# EAGLE schematic NIPCB (EAGLE 9.7.0)

## Sheet 1 of 6
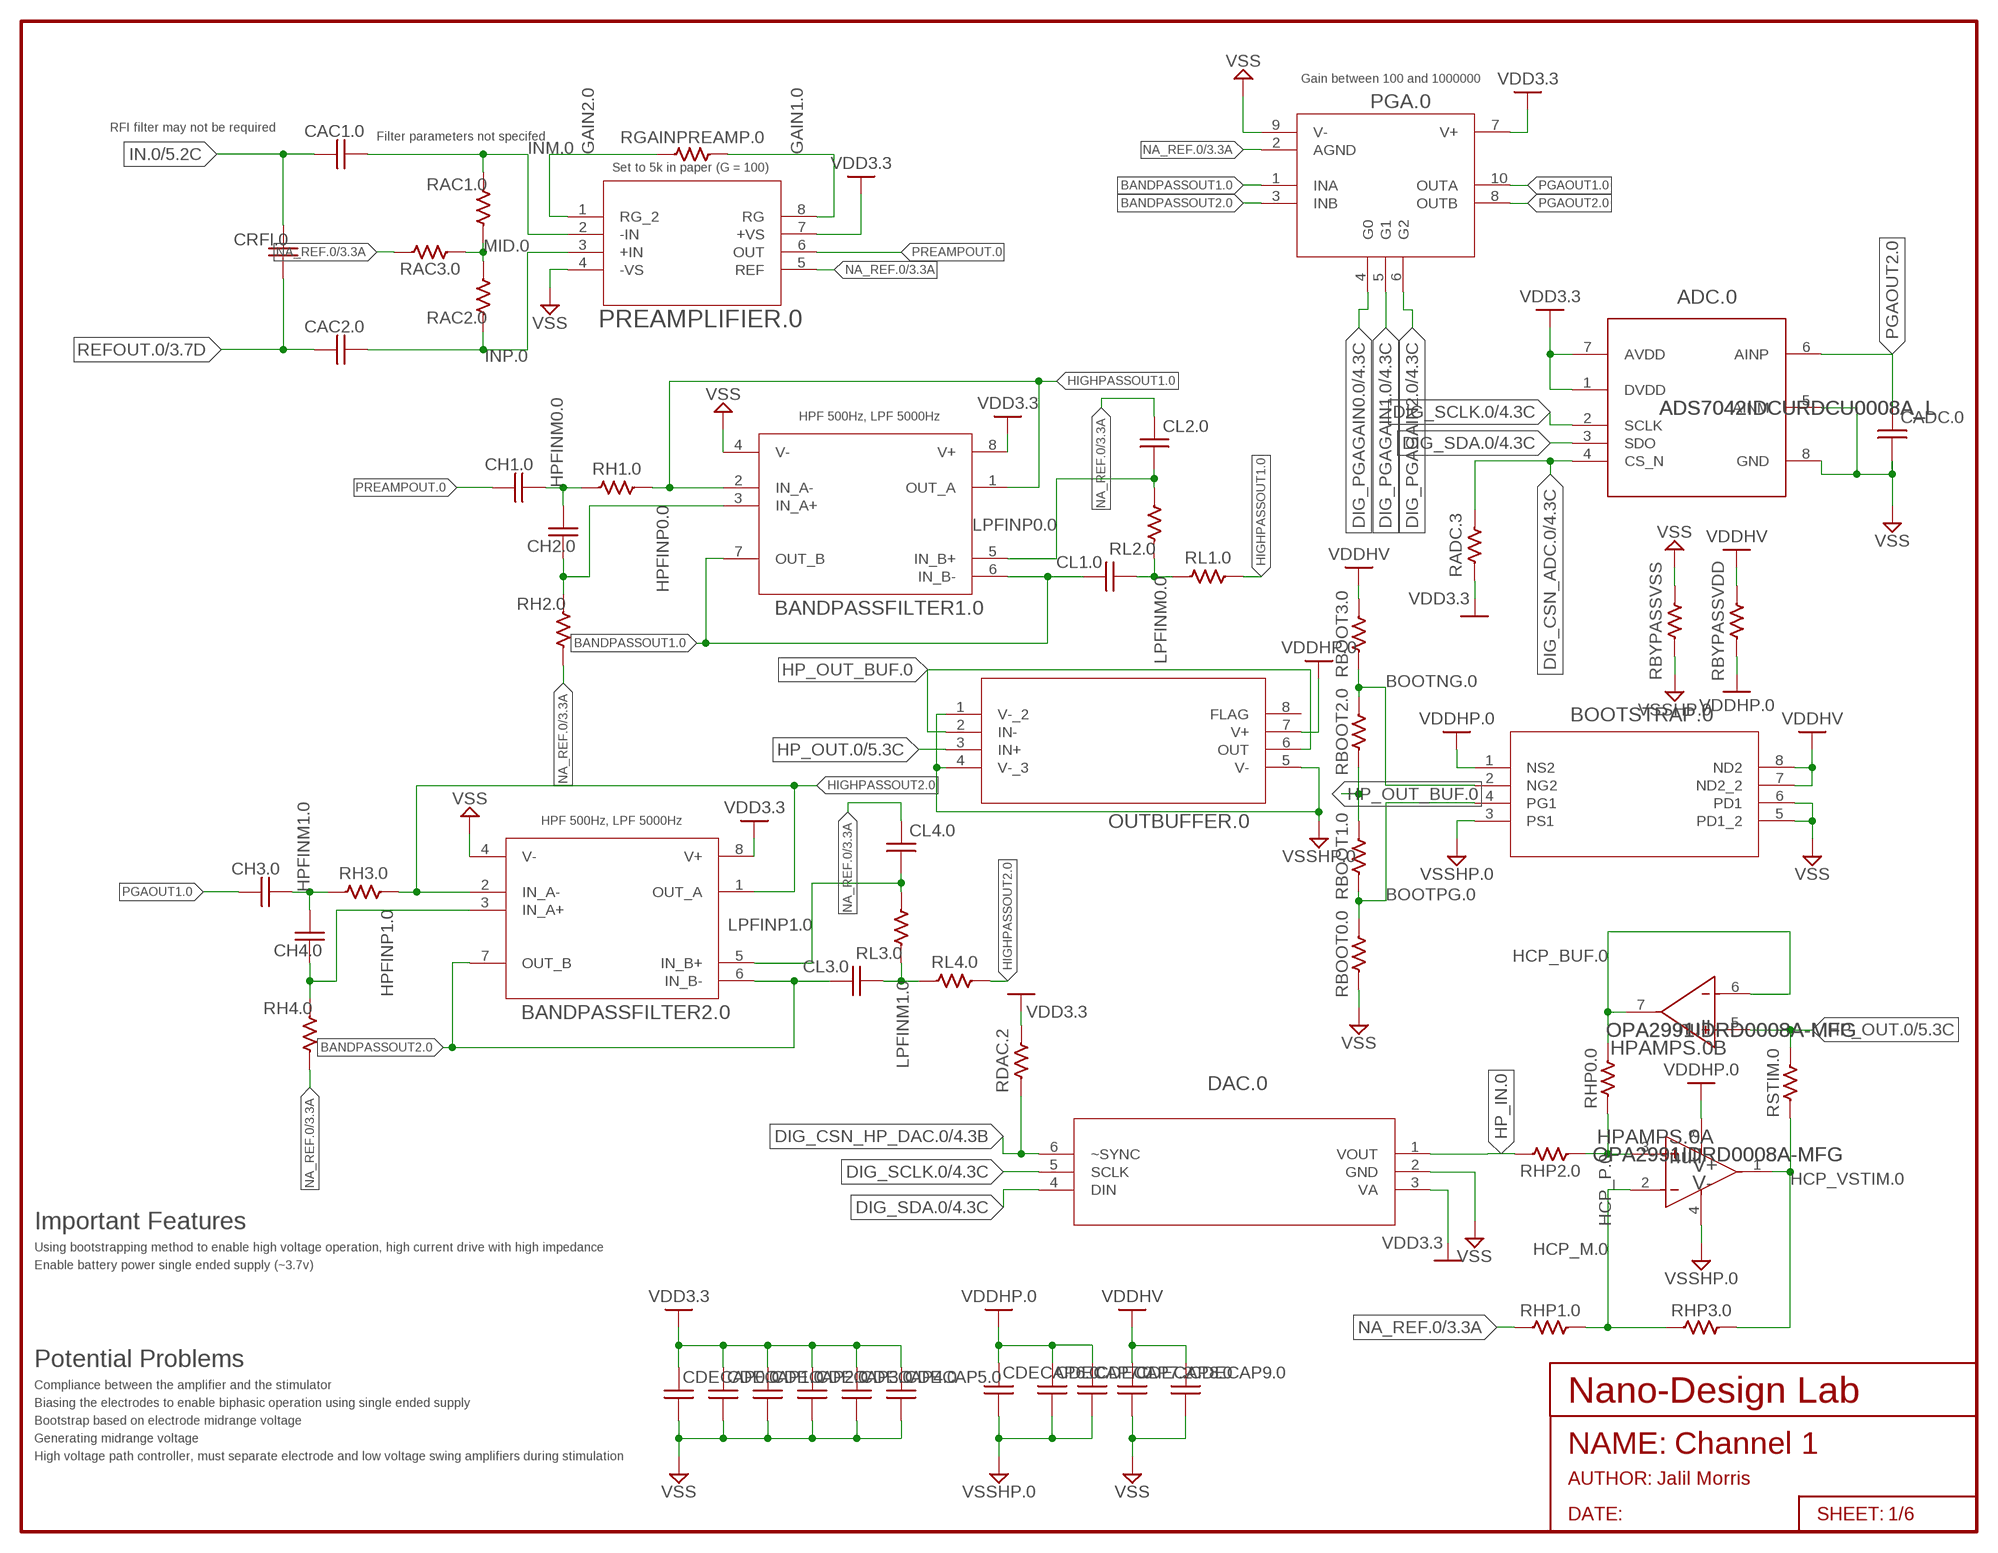
[diagram p0: schematic, sheet 1]
FRAME1 (FRAME): S_AUTHOR: Jalil Morris; S_NAME: Channel 1; S_ORGANIZATION: Nano-Design Lab

### Parts
ADC.0  ADS7042IDCURDCU0008A_L  [DCU0008A_L]
BANDPASSFILTER1.0  OPA2325IDRD8_TEX  [D8_TEX]
BANDPASSFILTER2.0  OPA2325IDRD8_TEX  [D8_TEX]
BOOTSTRAP.0  DMC4047LSD-13SO8_DIO  [SO8_DIO]
CAC1.0  C-US0402  [0402]
CAC2.0  C-US0402  [0402]
CADC.0  C-US0402  [0402]
CDECAP0.0  C-US0402  [0402]
CDECAP1.0  C-US0402  [0402]
CDECAP2.0  C-US0402  [0402]
CDECAP3.0  C-US0402  [0402]
CDECAP4.0  C-US0402  [0402]
CDECAP5.0  C-US0402  [0402]
CDECAP6.0  C-US0402  [0402]
CDECAP7.0  C-US0402  [0402]
CDECAP7.2  C-US0402  [0402]
CDECAP8.0  C-US0402  [0402]
CDECAP9.0  C-US0402  [0402]
CH1.0  C-US0402  [0402]
CH2.0  C-US0402  [0402]
CH3.0  C-US0402  [0402]
CH4.0  C-US0402  [0402]
CL1.0  C-US0402  [0402]
CL2.0  C-US0402  [0402]
CL3.0  C-US0402  [0402]
CL4.0  C-US0402  [0402]
CRFI.0  C-US0402  [0402]
DAC.0  DAC081S101CIMKX/NOPBMK06A  [MK06A]
HPAMPS.0  OPA2991IDRD0008A-MFG  [D0008A-MFG]
OUTBUFFER.0  OPA552UA/2K5D8  [D8]
PGA.0  LTC6911CMS-1TRPBFMSOP-10_MS_LIT  [MSOP-10_MS_LIT]
PREAMPLIFIER.0  INA818IDSOIC-8_TEX  [SOIC-8_TEX]
RAC1.0  R-US0402  [0402]
RAC2.0  R-US0402  [0402]
RAC3.0  R-US0402  [0402]
RADC.3  R-US0402  [0402]
RBOOT0.0  R-US0603  [0603]
RBOOT1.0  R-US0603  [0603]
RBOOT2.0  R-US0603  [0603]
RBOOT3.0  R-US0603  [0603]
RBYPASSVDD  R-US0402  [0402]
RBYPASSVSS  R-US0402  [0402]
RDAC.2  R-US0402  [0402]
RGAINPREAMP.0  R-US0402  [0402]
RH1.0  R-US0402  [0402]
RH2.0  R-US0402  [0402]
RH3.0  R-US0402  [0402]
RH4.0  R-US0402  [0402]
RHP0.0  R-US0603  [0603]
RHP1.0  R-US0603  [0603]
RHP2.0  R-US0603  [0603]
RHP3.0  R-US0603  [0603]
RL1.0  R-US0402  [0402]
RL2.0  R-US0402  [0402]
RL3.0  R-US0402  [0402]
RL4.0  R-US0402  [0402]
RSTIM.0  R-US0603  [0603]

### Nets
BANDPASSOUT1.0: BANDPASSFILTER1.0.6(IN_B-) BANDPASSFILTER1.0.7(OUT_B) CL1.0.1 PGA.0.1(INA)
BANDPASSOUT2.0: BANDPASSFILTER2.0.6(IN_B-) BANDPASSFILTER2.0.7(OUT_B) CL3.0.1 PGA.0.3(INB)
BOOTNG.0: BOOTSTRAP.0.2(NG2) RBOOT2.0.2 RBOOT3.0.1
BOOTPG.0: BOOTSTRAP.0.4(PG1) RBOOT0.0.2 RBOOT1.0.1
DIG_CSN_ADC.0: ADC.0.4(CS_N) RADC.3.1 ; also sheet 4
DIG_CSN_HP_DAC.0: DAC.0.6(~SYNC) RDAC.2.2 ; also sheet 4
DIG_PGAGAIN0.0: PGA.0.4(G0) ; also sheet 4
DIG_PGAGAIN1.0: PGA.0.5(G1) ; also sheet 4
DIG_PGAGAIN2.0: PGA.0.6(G2) ; also sheet 4
DIG_SCLK.0: ADC.0.2(SCLK) DAC.0.5(SCLK) ; also sheet 4
DIG_SDA.0: ADC.0.3(SDO) DAC.0.4(DIN) ; also sheet 4
GAIN1.0: PREAMPLIFIER.0.8(RG) RGAINPREAMP.0.1
GAIN2.0: PREAMPLIFIER.0.1(RG_2) RGAINPREAMP.0.2
HCP_BUF.0: HPAMPS.0.6(B:IN2-) HPAMPS.0.7(B:OUT2) RHP0.0.2
HCP_M.0: HPAMPS.0.2(A:IN1-) RHP1.0.2 RHP3.0.1
HCP_P.0: HPAMPS.0.3(A:IN1+) RHP0.0.1 RHP2.0.1
HCP_VSTIM.0: HPAMPS.0.1(A:OUT1) RHP3.0.2 RSTIM.0.1
HIGHPASSOUT1.0: BANDPASSFILTER1.0.1(OUT_A) BANDPASSFILTER1.0.2(IN_A-) RH1.0.1 RL1.0.1
HIGHPASSOUT2.0: BANDPASSFILTER2.0.1(OUT_A) BANDPASSFILTER2.0.2(IN_A-) RH3.0.1 RL4.0.1
HP_IN.0: DAC.0.1(VOUT) RHP2.0.2
HP_OUT.0: HPAMPS.0.5(B:IN2+) OUTBUFFER.0.3(IN+) RSTIM.0.2 ; also sheet 5
HP_OUT_BUF.0: OUTBUFFER.0.2(IN-) OUTBUFFER.0.6(OUT) RBOOT1.0.2 RBOOT2.0.1
HPFINM0.0: CH1.0.2 CH2.0.2 RH1.0.2
HPFINM1.0: CH3.0.2 CH4.0.2 RH3.0.2
HPFINP0.0: BANDPASSFILTER1.0.3(IN_A+) CH2.0.1 RH2.0.1
HPFINP1.0: BANDPASSFILTER2.0.3(IN_A+) CH4.0.1 RH4.0.1
IN.0: CAC1.0.1 CRFI.0.2 ; also sheet 5
INM.0: CAC1.0.2 PREAMPLIFIER.0.2(-IN) RAC1.0.2
INP.0: CAC2.0.2 PREAMPLIFIER.0.3(+IN) RAC2.0.1
LPFINM0.0: CL1.0.2 RL1.0.2 RL2.0.1
LPFINM1.0: CL3.0.2 RL3.0.1 RL4.0.2
LPFINP0.0: BANDPASSFILTER1.0.5(IN_B+) CL2.0.1 RL2.0.2
LPFINP1.0: BANDPASSFILTER2.0.5(IN_B+) CL4.0.1 RL3.0.2
MID.0: RAC1.0.1 RAC2.0.2 RAC3.0.1
NA_REF.0: CL2.0.2 CL4.0.2 PGA.0.2(AGND) PREAMPLIFIER.0.5(REF) RAC3.0.2 RH2.0.2 RH4.0.2 RHP1.0.1 ; also sheet 3
PGAOUT1.0: CH3.0.1 PGA.0.10(OUTA)
PGAOUT2.0: ADC.0.6(AINP) CADC.0.2 PGA.0.8(OUTB)
PREAMPOUT.0: CH1.0.1 PREAMPLIFIER.0.6(OUT)
REFOUT.0: CAC2.0.1 CRFI.0.1 ; also sheet 3,5
VDD3.3 [power]: ADC.0.1(DVDD) ADC.0.7(AVDD) BANDPASSFILTER1.0.8(V+) BANDPASSFILTER2.0.8(V+) CDECAP0.0.1 CDECAP1.0.1 CDECAP2.0.1 CDECAP3.0.1 CDECAP4.0.1 CDECAP5.0.1 DAC.0.3(VA) PGA.0.7(V+) PREAMPLIFIER.0.7(+VS) RADC.3.2 RDAC.2.1 ; also sheet 2,3,4
VDDHP.0: BOOTSTRAP.0.1(NS2) CDECAP6.0.1 CDECAP7.0.1 CDECAP7.2.1 HPAMPS.0.8(A:V+) OUTBUFFER.0.7(V+) RBYPASSVDD.2
VDDHV: BOOTSTRAP.0.7(ND2_2) BOOTSTRAP.0.8(ND2) CDECAP8.0.1 CDECAP9.0.1 RBOOT3.0.2 RBYPASSVDD.1 ; also sheet 2,3,5
VSS: ADC.0.5(AINM) ADC.0.8(GND) BANDPASSFILTER1.0.4(V-) BANDPASSFILTER2.0.4(V-) BOOTSTRAP.0.5(PD1_2) BOOTSTRAP.0.6(PD1) CADC.0.1 CDECAP0.0.2 CDECAP1.0.2 CDECAP2.0.2 CDECAP3.0.2 CDECAP4.0.2 CDECAP5.0.2 CDECAP8.0.2 CDECAP9.0.2 DAC.0.2(GND) PGA.0.9(V-) PREAMPLIFIER.0.4(-VS) RBOOT0.0.1 RBYPASSVSS.1 ; also sheet 2,3,4,5
VSSHP.0: BOOTSTRAP.0.3(PS1) CDECAP6.0.2 CDECAP7.0.2 CDECAP7.2.2 HPAMPS.0.4(A:V-) OUTBUFFER.0.1(V-_2) OUTBUFFER.0.4(V-_3) OUTBUFFER.0.5(V-) RBYPASSVSS.2
Unconnected: OUTBUFFER.0.8(FLAG)

### Notes on the sheet
- Gain between 100 and 1000000
- RFI filter may not be required
- Filter parameters not specifed
- Set to 5k in paper (G = 100)
- HPF 500Hz, LPF 5000Hz
- HPF 500Hz, LPF 5000Hz
- Important Features
- Using bootstrapping method to enable high voltage operation, high current drive with high impedance
- Enable battery power single ended supply (~3.7v)
- Potential Problems
- Compliance between the amplifier and the stimulator
- Biasing the electrodes to enable biphasic operation using single ended supply
- Bootstrap based on electrode midrange voltage
- Generating midrange voltage
- High voltage path controller, must separate electrode and low voltage swing amplifiers during stimulation

## Sheet 2 of 6
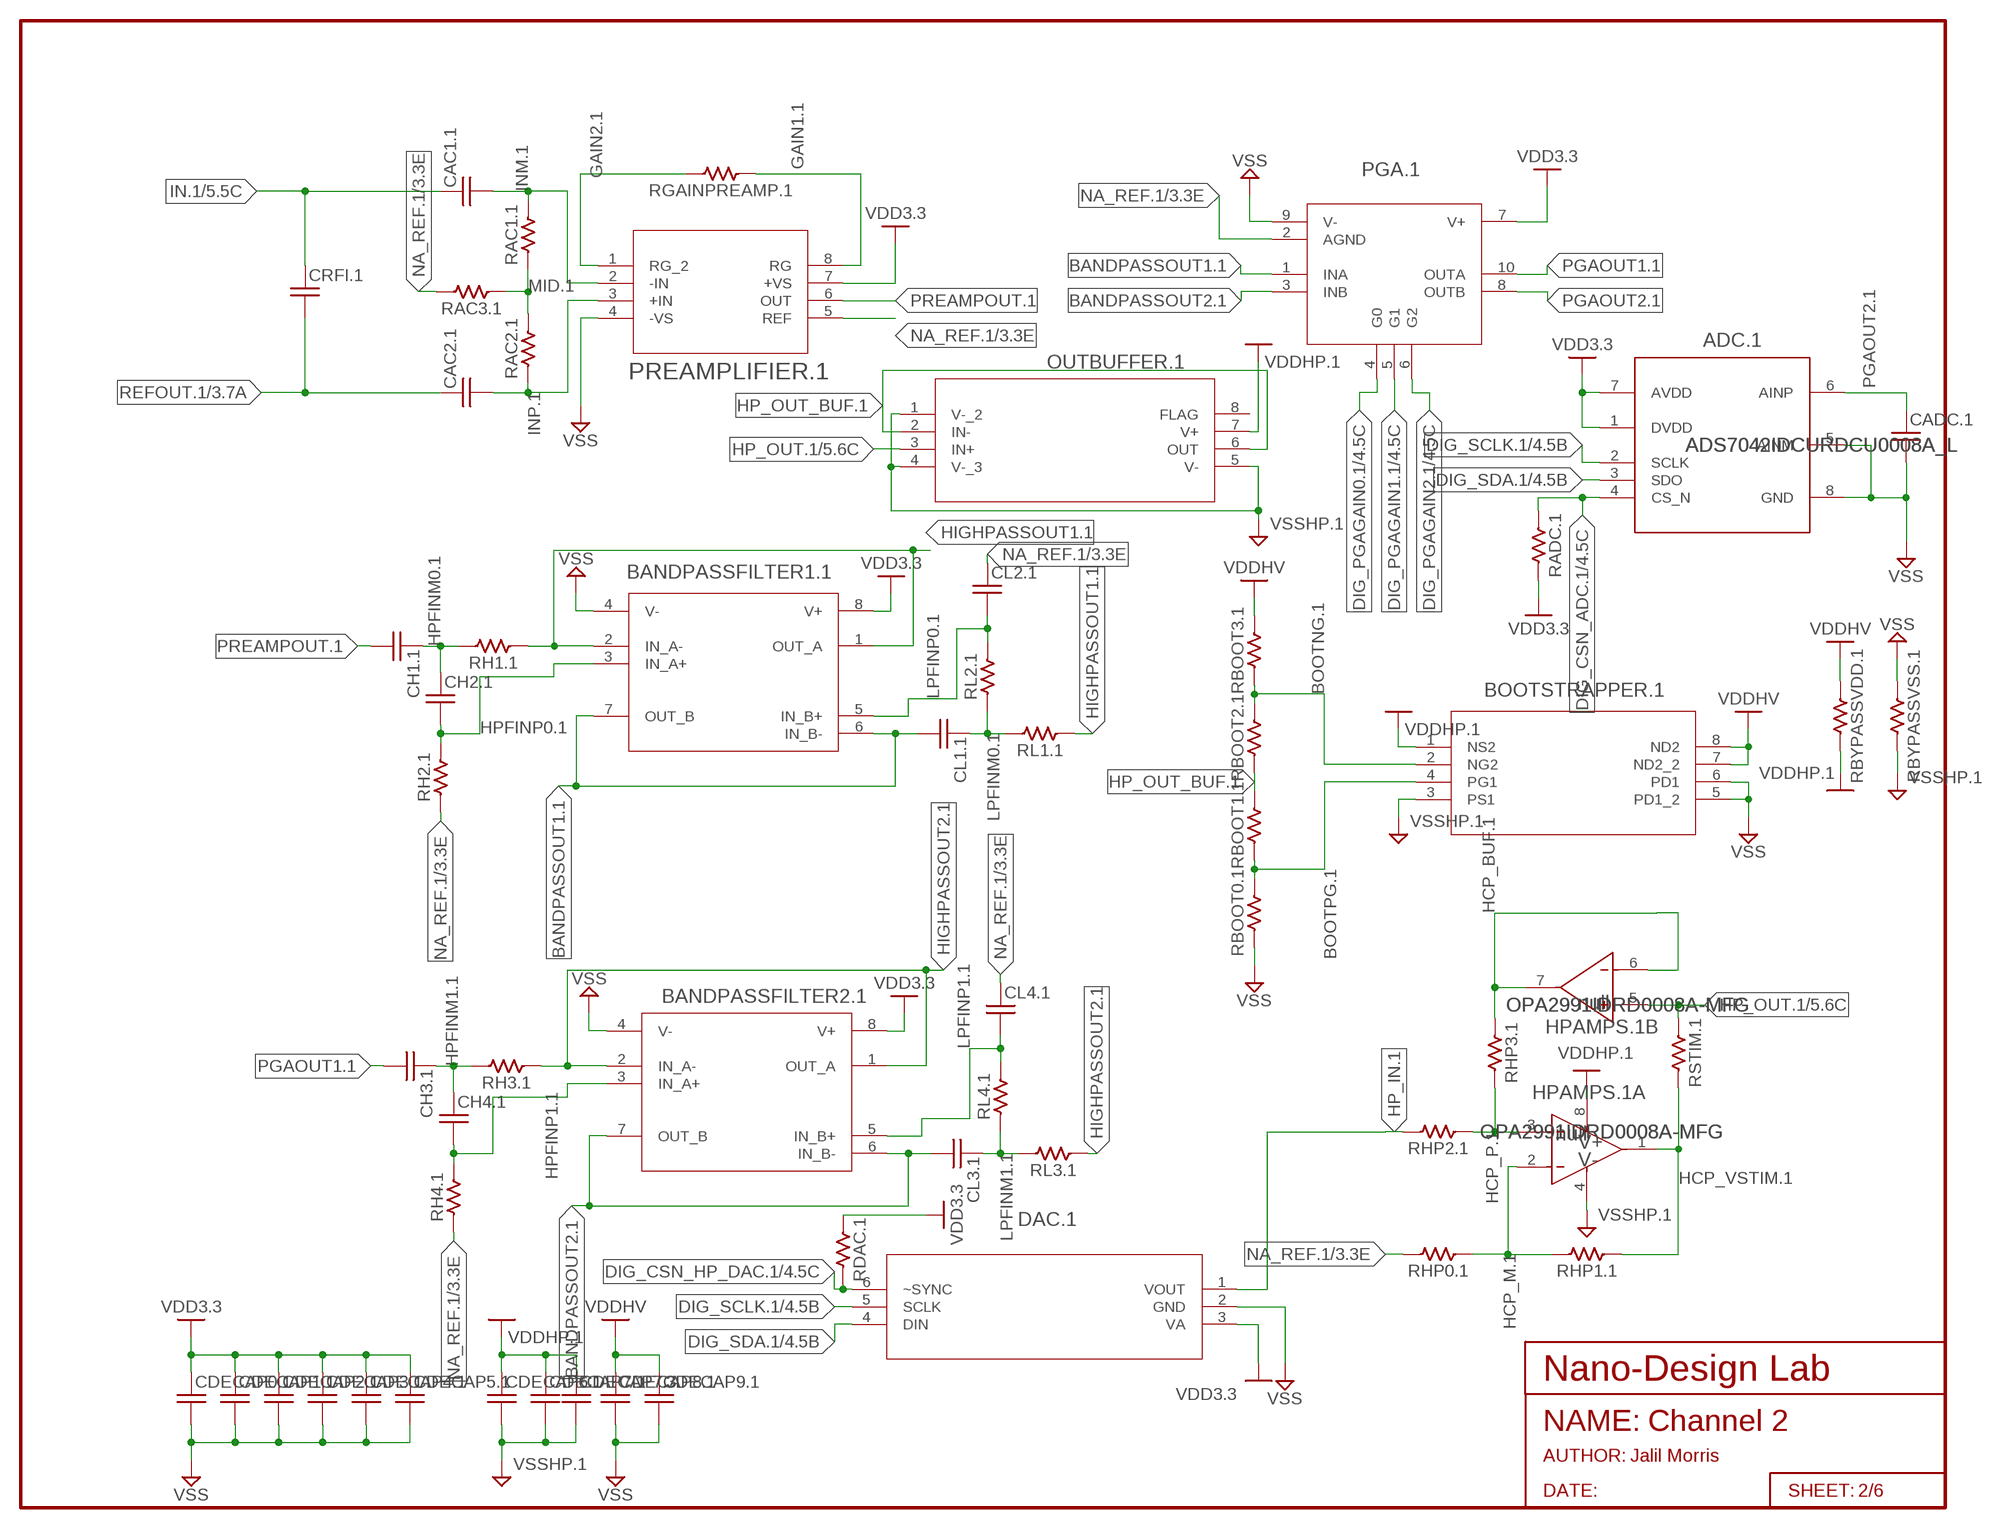
[diagram p1: schematic, sheet 2]
FRAME4 (FRAME): S_AUTHOR: Jalil Morris; S_NAME: Channel 2; S_ORGANIZATION: Nano-Design Lab

### Parts
ADC.1  ADS7042IDCURDCU0008A_L  [DCU0008A_L]
BANDPASSFILTER1.1  OPA2325IDRD8_TEX-L  [D8_TEX-L]
BANDPASSFILTER2.1  OPA2325IDRD8_TEX-L  [D8_TEX-L]
BOOTSTRAPPER.1  DMC4047LSD-13SO8_DIO  [SO8_DIO]
CAC1.1  C-US0402  [0402]
CAC2.1  C-US0402  [0402]
CADC.1  C-US0402  [0402]
CDECAP0.1  C-US0402  [0402]
CDECAP1.1  C-US0402  [0402]
CDECAP2.1  C-US0402  [0402]
CDECAP3.1  C-US0402  [0402]
CDECAP4.1  C-US0402  [0402]
CDECAP5.1  C-US0402  [0402]
CDECAP6.1  C-US0402  [0402]
CDECAP7.1  C-US0402  [0402]
CDECAP7.3  C-US0402  [0402]
CDECAP8.1  C-US0402  [0402]
CDECAP9.1  C-US0402  [0402]
CH1.1  C-US0402  [0402]
CH2.1  C-US0402  [0402]
CH3.1  C-US0402  [0402]
CH4.1  C-US0402  [0402]
CL1.1  C-US0402  [0402]
CL2.1  C-US0402  [0402]
CL3.1  C-US0402  [0402]
CL4.1  C-US0402  [0402]
CRFI.1  C-US0402  [0402]
DAC.1  DAC081S101CIMKX/NOPBMK06A  [MK06A]
HPAMPS.1  OPA2991IDRD0008A-MFG  [D0008A-MFG]
OUTBUFFER.1  OPA552UA/2K5D8  [D8]
PGA.1  LTC6911CMS-1TRPBFMSOP-10_MS_LIT  [MSOP-10_MS_LIT]
PREAMPLIFIER.1  INA818IDSOIC-8_TEX  [SOIC-8_TEX]
RAC1.1  R-US0402  [0402]
RAC2.1  R-US0402  [0402]
RAC3.1  R-US0402  [0402]
RADC.1  R-US0402  [0402]
RBOOT0.1  R-US0603  [0603]
RBOOT1.1  R-US0603  [0603]
RBOOT2.1  R-US0603  [0603]
RBOOT3.1  R-US0603  [0603]
RBYPASSVDD.1  R-US0402  [0402]
RBYPASSVSS.1  R-US0402  [0402]
RDAC.1  R-US0402  [0402]
RGAINPREAMP.1  R-US0402  [0402]
RH1.1  R-US0402  [0402]
RH2.1  R-US0402  [0402]
RH3.1  R-US0402  [0402]
RH4.1  R-US0402  [0402]
RHP0.1  R-US0603  [0603]
RHP1.1  R-US0603  [0603]
RHP2.1  R-US0603  [0603]
RHP3.1  R-US0603  [0603]
RL1.1  R-US0402  [0402]
RL2.1  R-US0402  [0402]
RL3.1  R-US0402  [0402]
RL4.1  R-US0402  [0402]
RSTIM.1  R-US0603  [0603]

### Nets
BANDPASSOUT1.1: BANDPASSFILTER1.1.6(IN_B-) BANDPASSFILTER1.1.7(OUT_B) CL1.1.2 PGA.1.1(INA)
BANDPASSOUT2.1: BANDPASSFILTER2.1.6(IN_B-) BANDPASSFILTER2.1.7(OUT_B) CL3.1.2 PGA.1.3(INB)
BOOTNG.1: BOOTSTRAPPER.1.2(NG2) RBOOT2.1.2 RBOOT3.1.1
BOOTPG.1: BOOTSTRAPPER.1.4(PG1) RBOOT0.1.2 RBOOT1.1.1
DIG_CSN_ADC.1: ADC.1.4(CS_N) RADC.1.1 ; also sheet 4
DIG_CSN_HP_DAC.1: DAC.1.6(~SYNC) RDAC.1.2 ; also sheet 4
DIG_PGAGAIN0.1: PGA.1.4(G0) ; also sheet 4
DIG_PGAGAIN1.1: PGA.1.5(G1) ; also sheet 4
DIG_PGAGAIN2.1: PGA.1.6(G2) ; also sheet 4
DIG_SCLK.1: ADC.1.2(SCLK) DAC.1.5(SCLK) ; also sheet 4
DIG_SDA.1: ADC.1.3(SDO) DAC.1.4(DIN) ; also sheet 4
GAIN1.1: PREAMPLIFIER.1.8(RG) RGAINPREAMP.1.1
GAIN2.1: PREAMPLIFIER.1.1(RG_2) RGAINPREAMP.1.2
HCP_BUF.1: HPAMPS.1.6(B:IN2-) HPAMPS.1.7(B:OUT2) RHP3.1.1
HCP_M.1: HPAMPS.1.2(A:IN1-) RHP0.1.1 RHP1.1.2
HCP_P.1: HPAMPS.1.3(A:IN1+) RHP2.1.1 RHP3.1.2
HCP_VSTIM.1: HPAMPS.1.1(A:OUT1) RHP1.1.1 RSTIM.1.2
HIGHPASSOUT1.1: BANDPASSFILTER1.1.1(OUT_A) BANDPASSFILTER1.1.2(IN_A-) RH1.1.1 RL1.1.1
HIGHPASSOUT2.1: BANDPASSFILTER2.1.1(OUT_A) BANDPASSFILTER2.1.2(IN_A-) RH3.1.1 RL3.1.1
HP_IN.1: DAC.1.1(VOUT) RHP2.1.2
HP_OUT.1: HPAMPS.1.5(B:IN2+) OUTBUFFER.1.3(IN+) RSTIM.1.1 ; also sheet 5
HP_OUT_BUF.1: OUTBUFFER.1.2(IN-) OUTBUFFER.1.6(OUT) RBOOT1.1.2 RBOOT2.1.1
HPFINM0.1: CH1.1.1 CH2.1.1 RH1.1.2
HPFINM1.1: CH3.1.1 CH4.1.1 RH3.1.2
HPFINP0.1: BANDPASSFILTER1.1.3(IN_A+) CH2.1.2 RH2.1.2
HPFINP1.1: BANDPASSFILTER2.1.3(IN_A+) CH4.1.2 RH4.1.2
IN.1: CAC1.1.1 CRFI.1.1 ; also sheet 5
INM.1: CAC1.1.2 PREAMPLIFIER.1.2(-IN) RAC1.1.2
INP.1: CAC2.1.2 PREAMPLIFIER.1.3(+IN) RAC2.1.1
LPFINM0.1: CL1.1.1 RL1.1.2 RL2.1.1
LPFINM1.1: CL3.1.1 RL3.1.2 RL4.1.1
LPFINP0.1: BANDPASSFILTER1.1.5(IN_B+) CL2.1.2 RL2.1.2
LPFINP1.1: BANDPASSFILTER2.1.5(IN_B+) CL4.1.2 RL4.1.2
MID.1: RAC1.1.1 RAC2.1.2 RAC3.1.1
NA_REF.1: CL2.1.1 CL4.1.1 PGA.1.2(AGND) PREAMPLIFIER.1.5(REF) RAC3.1.2 RH2.1.1 RH4.1.1 RHP0.1.2 ; also sheet 3
PGAOUT1.1: CH3.1.2 PGA.1.10(OUTA)
PGAOUT2.1: ADC.1.6(AINP) CADC.1.1 PGA.1.8(OUTB)
PREAMPOUT.1: CH1.1.2 PREAMPLIFIER.1.6(OUT)
REFOUT.1: CAC2.1.1 CRFI.1.2 ; also sheet 3,5
VDD3.3 [power]: ADC.1.1(DVDD) ADC.1.7(AVDD) BANDPASSFILTER1.1.8(V+) BANDPASSFILTER2.1.8(V+) CDECAP0.1.1 CDECAP1.1.1 CDECAP2.1.1 CDECAP3.1.1 CDECAP4.1.1 CDECAP5.1.1 DAC.1.3(VA) PGA.1.7(V+) PREAMPLIFIER.1.7(+VS) RADC.1.2 RDAC.1.1 ; also sheet 1,3,4
VDDHP.1: BOOTSTRAPPER.1.1(NS2) CDECAP6.1.1 CDECAP7.1.1 CDECAP7.3.1 HPAMPS.1.8(A:V+) OUTBUFFER.1.7(V+) RBYPASSVDD.1.2
VDDHV: BOOTSTRAPPER.1.7(ND2_2) BOOTSTRAPPER.1.8(ND2) CDECAP8.1.1 CDECAP9.1.1 RBOOT3.1.2 RBYPASSVDD.1.1 ; also sheet 1,3,5
VSS: ADC.1.5(AINM) ADC.1.8(GND) BANDPASSFILTER1.1.4(V-) BANDPASSFILTER2.1.4(V-) BOOTSTRAPPER.1.5(PD1_2) BOOTSTRAPPER.1.6(PD1) CADC.1.2 CDECAP0.1.2 CDECAP1.1.2 CDECAP2.1.2 CDECAP3.1.2 CDECAP4.1.2 CDECAP5.1.2 CDECAP8.1.2 CDECAP9.1.2 DAC.1.2(GND) PGA.1.9(V-) PREAMPLIFIER.1.4(-VS) RBOOT0.1.1 RBYPASSVSS.1.1 ; also sheet 1,3,4,5
VSSHP.1: BOOTSTRAPPER.1.3(PS1) CDECAP6.1.2 CDECAP7.1.2 CDECAP7.3.2 HPAMPS.1.4(A:V-) OUTBUFFER.1.1(V-_2) OUTBUFFER.1.4(V-_3) OUTBUFFER.1.5(V-) RBYPASSVSS.1.2
Unconnected: OUTBUFFER.1.8(FLAG)

## Sheet 3 of 6
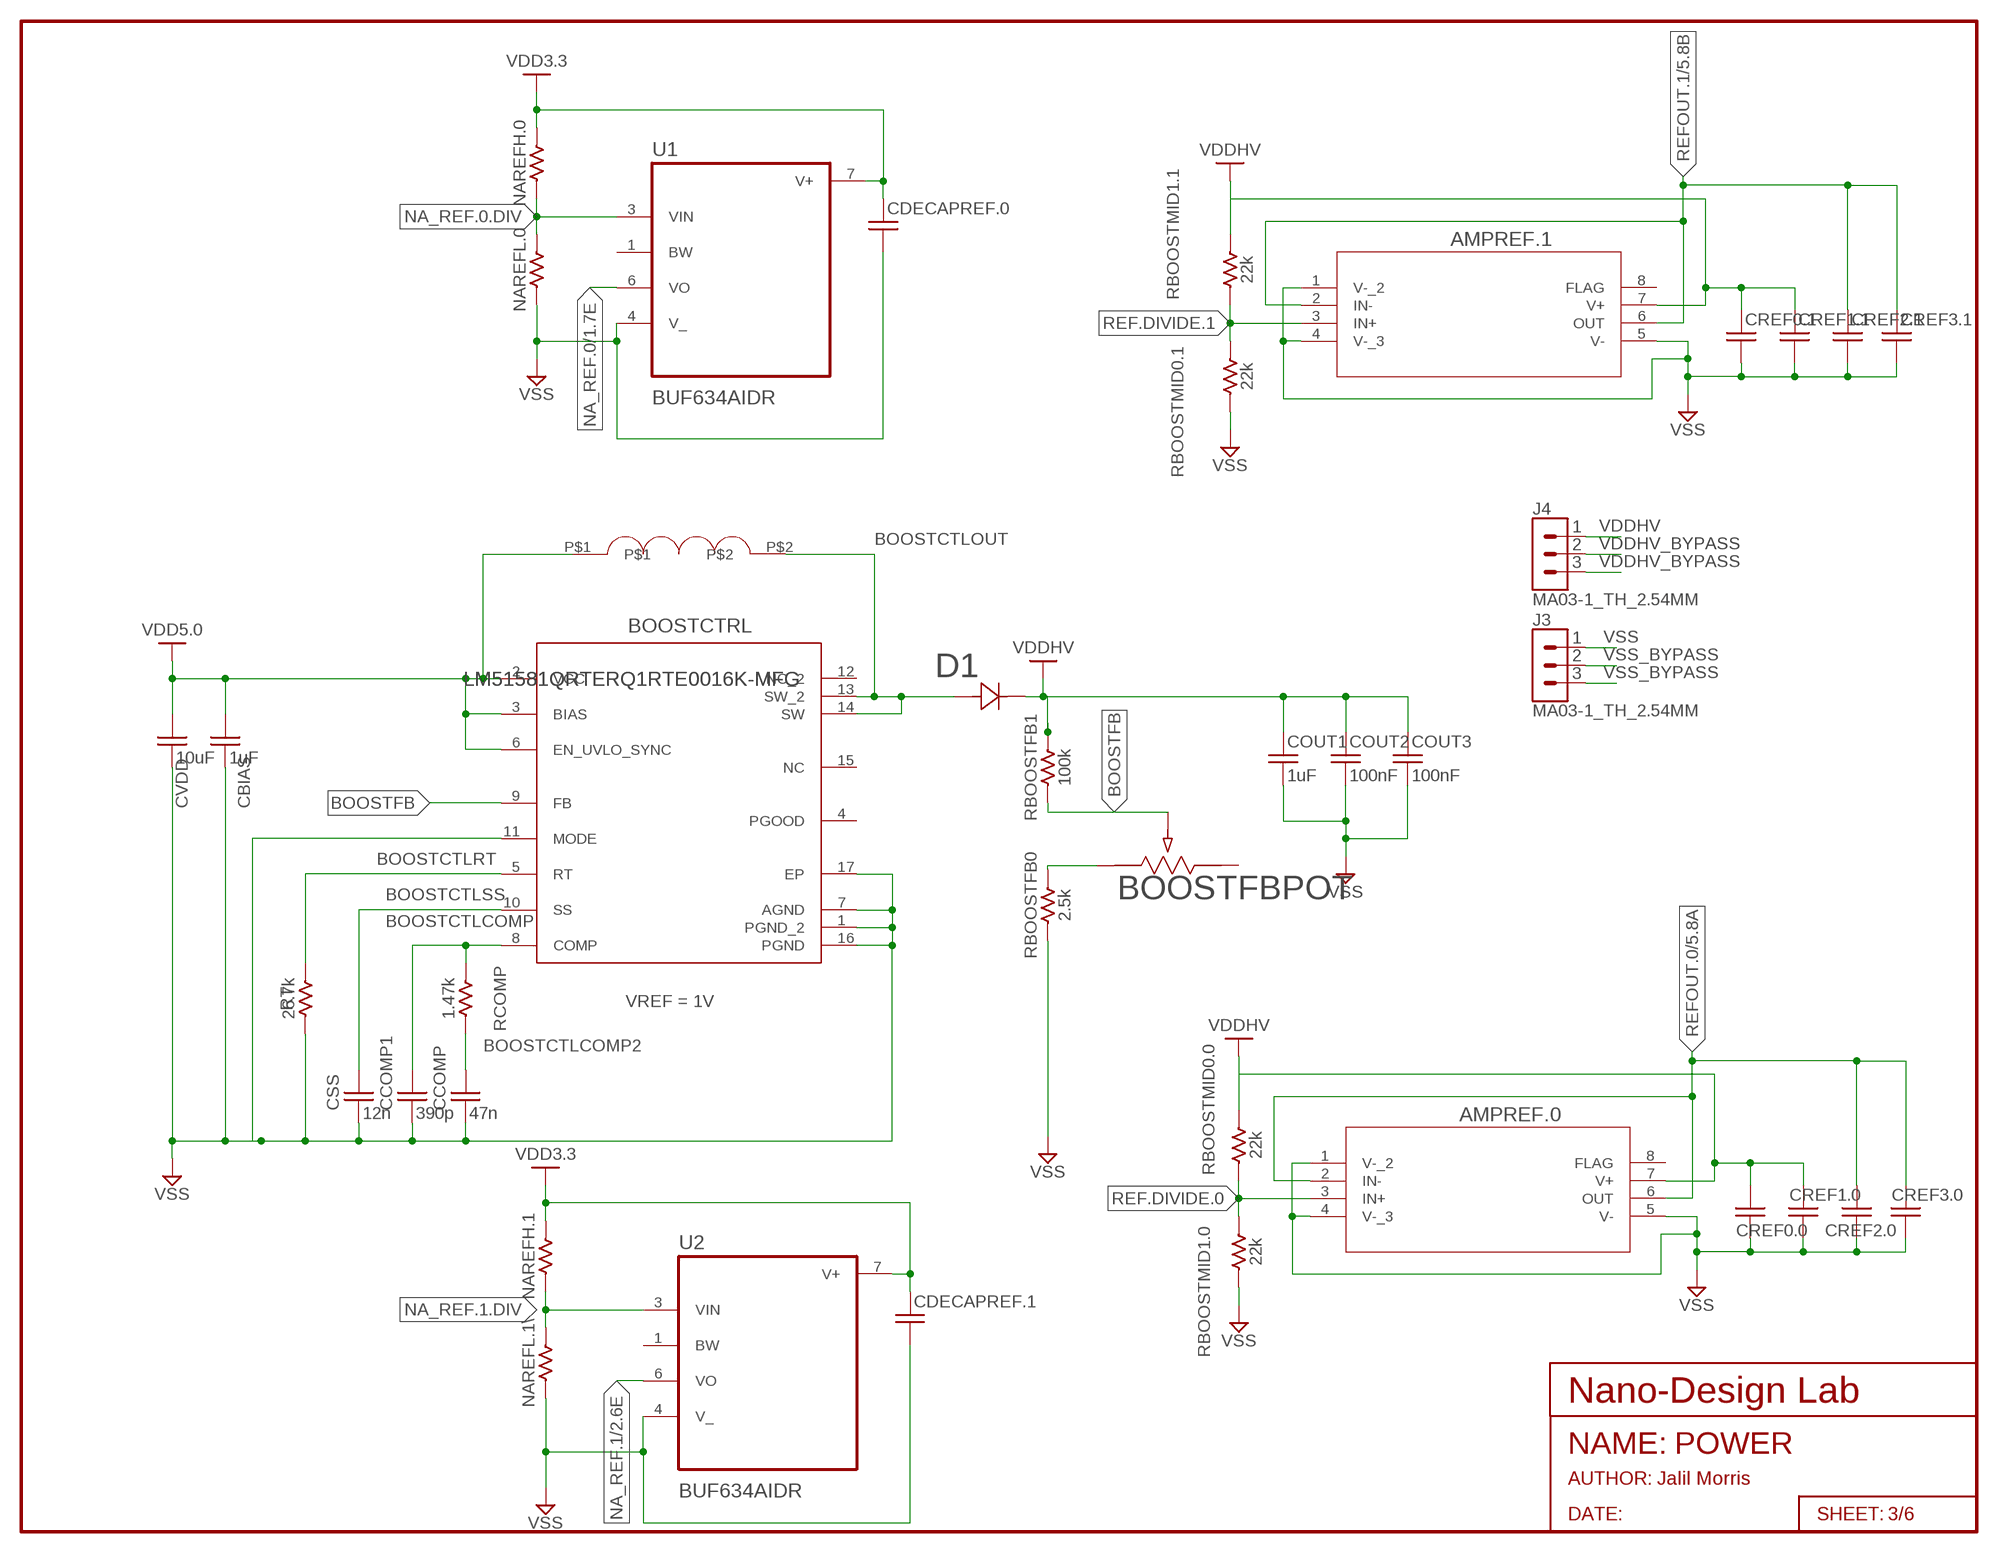
[diagram p2: schematic, sheet 3]
FRAME2 (FRAME): S_AUTHOR: Jalil Morris; S_NAME: POWER; S_ORGANIZATION: Nano-Design Lab

### Parts
AMPREF.0  OPA552UA/2K5D8  [D8]
AMPREF.1  OPA552UA/2K5D8  [D8]
BOOSTCTRL  LM51581QRTERQ1RTE0016K-MFG  [RTE0016K-MFG]
BOOSTFBPOT  3362P-1-103LFPOT_3362P  [POT_3362P]
CBIAS  1uF  C-US0805  [0805]
CCOMP  47n  C-US0603  [0603]
CCOMP1  390p  C-US0603  [0603]
CDECAPREF.0  C-US0402  [0402]
CDECAPREF.1  C-US0402  [0402]
COUT1  1uF  C-US0805  [0805]
COUT2  100nF  C-US0805  [0805]
COUT3  100nF  C-US0805  [0805]
CREF0.0  C-US0603  [0603]
CREF0.1  C-US0603  [0603]
CREF1.0  C-US0805  [0805]
CREF1.1  C-US0805  [0805]
CREF2.0  C-US0603  [0603]
CREF2.1  C-US0603  [0603]
CREF3.0  C-US0805  [0805]
CREF3.1  C-US0805  [0805]
CSS  12n  C-US0603  [0603]
CVDD  10uF  C-US0805  [0805]
D1  B160-13-FSMA_DIO  [SMA_DIO]
J3  MA03-1_TH_2.54MM  [MA03-1_TH_2.54MM]
J4  MA03-1_TH_2.54MM  [MA03-1_TH_2.54MM]
NAREFH.0  R-US0402  [0402]
NAREFH.1  R-US0402  [0402]
NAREFL.0  R-US0402  [0402]
NAREFL.1\  R-US0402  [0402]
RBOOSTFB0  2.5k  R-US0603  [0603]
RBOOSTFB1  100k  R-US0603  [0603]
RBOOSTMID0.0  22k  R-US0603  [0603]
RBOOSTMID0.1  22k  R-US0603  [0603]
RBOOSTMID1.0  22k  R-US0603  [0603]
RBOOSTMID1.1  22k  R-US0603  [0603]
RCOMP  1.47k  R-US0603  [0603]
RT  26.7k  R-US0603  [0603]
U1  BUF634AIDR  [SOIC127P599X175-8N]
U2  BUF634AIDR  [SOIC127P599X175-8N]
U$1  MSS1246-COILCRAFT  [MSS1246-COILCRAFT]

### Nets
BOOSTCTLCOMP: BOOSTCTRL.8(COMP) CCOMP1.1 RCOMP.1
BOOSTCTLCOMP2: CCOMP.1 RCOMP.2
BOOSTCTLOUT: BOOSTCTRL.13(SW_2) BOOSTCTRL.14(SW) D1.2 U$1.P$2
BOOSTCTLRT: BOOSTCTRL.5(RT) RT.1
BOOSTCTLSS: BOOSTCTRL.10(SS) CSS.1
BOOSTFB: BOOSTCTRL.9(FB) BOOSTFBPOT.2 RBOOSTFB1.1
N$6: BOOSTFBPOT.1 RBOOSTFB0.2
NA_REF.0: U1.6(VO) ; also sheet 1
NA_REF.0.DIV: NAREFH.0.1 NAREFL.0.2 U1.3(VIN)
NA_REF.1: U2.6(VO) ; also sheet 2
NA_REF.1.DIV: NAREFH.1.1 NAREFL.1\.2 U2.3(VIN)
REF.DIVIDE.0: AMPREF.0.3(IN+) RBOOSTMID0.0.1 RBOOSTMID1.0.2
REF.DIVIDE.1: AMPREF.1.3(IN+) RBOOSTMID0.1.2 RBOOSTMID1.1.1
REFOUT.0: AMPREF.0.2(IN-) AMPREF.0.6(OUT) CREF2.0.1 CREF3.0.1 ; also sheet 1,5
REFOUT.1: AMPREF.1.2(IN-) AMPREF.1.6(OUT) CREF2.1.1 CREF3.1.1 ; also sheet 2,5
VDD3.3 [power]: CDECAPREF.0.1 CDECAPREF.1.1 NAREFH.0.2 NAREFH.1.2 U1.7(V+) U2.7(V+) ; also sheet 1,2,4
VDD5.0 [power]: BOOSTCTRL.2(VCC) BOOSTCTRL.3(BIAS) BOOSTCTRL.6(EN_UVLO_SYNC) CBIAS.1 CVDD.1 U$1.P$1 ; also sheet 4
VDDHV: AMPREF.0.7(V+) AMPREF.1.7(V+) COUT1.1 COUT2.1 COUT3.1 CREF0.0.1 CREF0.1.1 CREF1.0.1 CREF1.1.1 D1.1 J4.1 RBOOSTFB1.2 RBOOSTMID0.0.2 RBOOSTMID1.1.2 ; also sheet 1,2,5
VDDHV_BYPASS: J4.2 J4.3
VSS: AMPREF.0.1(V-_2) AMPREF.0.4(V-_3) AMPREF.0.5(V-) AMPREF.1.1(V-_2) AMPREF.1.4(V-_3) AMPREF.1.5(V-) BOOSTCTRL.1(PGND_2) BOOSTCTRL.7(AGND) BOOSTCTRL.11(MODE) BOOSTCTRL.16(PGND) BOOSTCTRL.17(EP) CBIAS.2 CCOMP1.2 CCOMP.2 CDECAPREF.0.2 CDECAPREF.1.2 COUT1.2 COUT2.2 COUT3.2 CREF0.0.2 CREF0.1.2 CREF1.0.2 CREF1.1.2 CREF2.0.2 CREF2.1.2 CREF3.0.2 CREF3.1.2 CSS.2 CVDD.2 J3.1 NAREFL.0.1 NAREFL.1\.1 RBOOSTFB0.1 RBOOSTMID0.1.1 RBOOSTMID1.0.1 RT.2 U1.4(V_) U2.4(V_) ; also sheet 1,2,4,5
VSS_BYPASS: J3.2 J3.3
Unconnected: AMPREF.0.8(FLAG) AMPREF.1.8(FLAG) BOOSTCTRL.4(PGOOD) BOOSTCTRL.12(NC_2) BOOSTCTRL.15(NC) BOOSTFBPOT.3 U1.1(BW) U2.1(BW)

### Notes on the sheet
- VREF = 1V

## Sheet 4 of 6
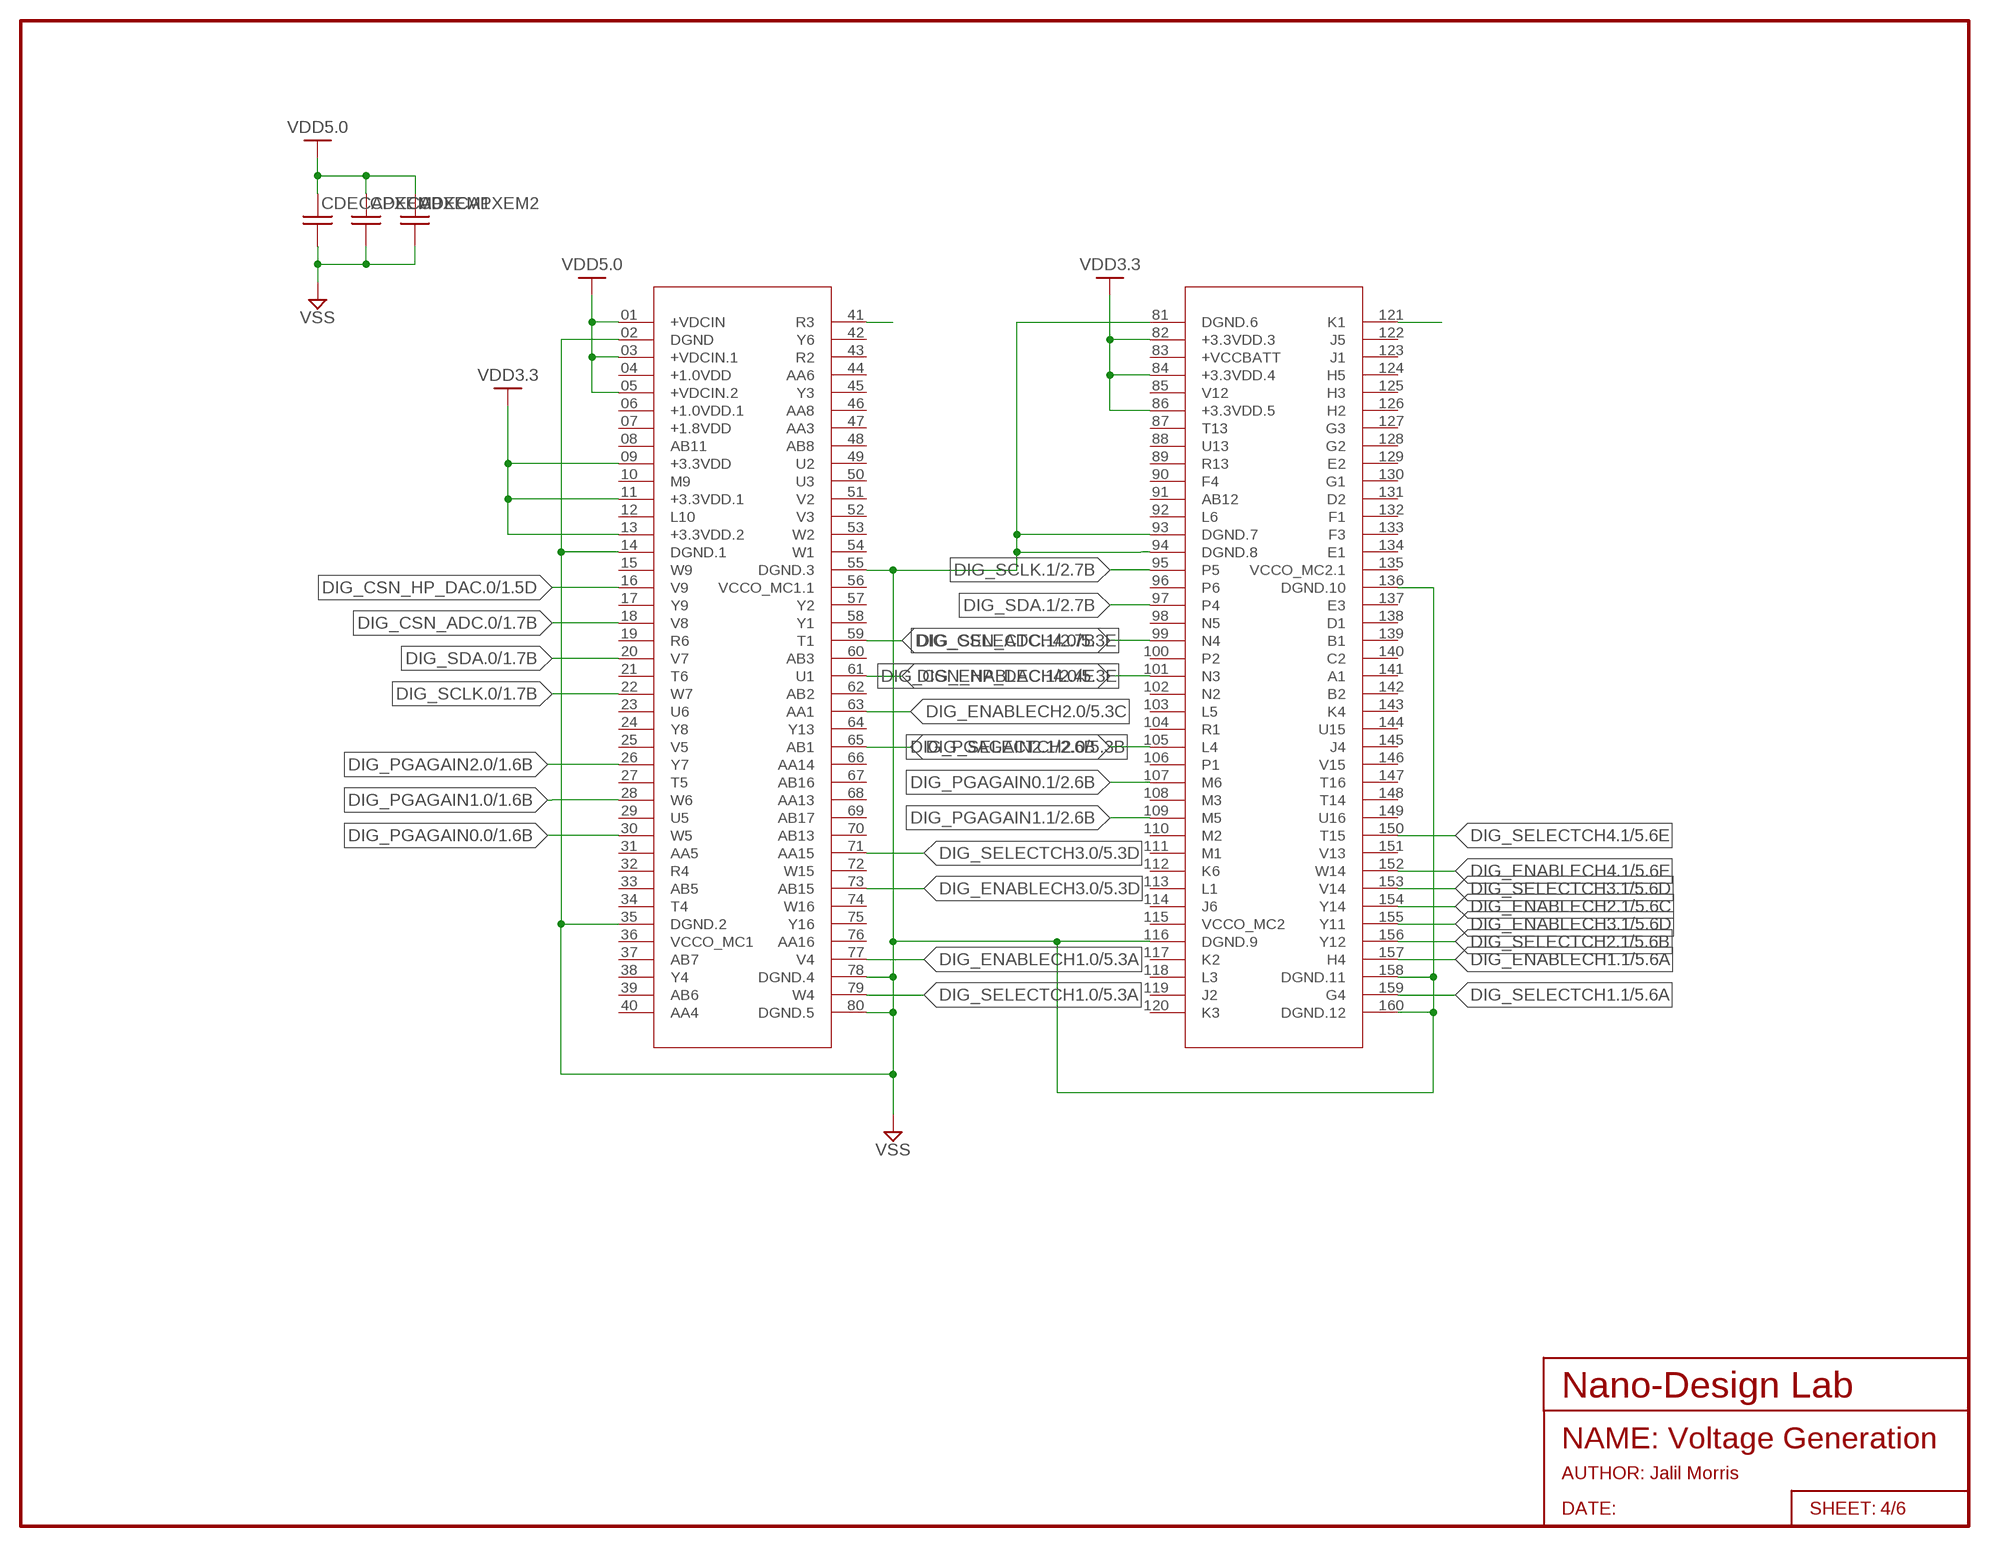
[diagram p3: schematic, sheet 4]
FRAME3 (FRAME): S_AUTHOR: Jalil Morris; S_NAME: Voltage Generation; S_ORGANIZATION: Nano-Design Lab

### Parts
CDECAPXEM0  C-US0805  [0805]
CDECAPXEM1  C-US0603  [0603]
CDECAPXEM2  C-US0603  [0603]
U$2  XEM7310  [XEM7310]

### Nets
DIG_CSN_ADC.0: U$2.18(V8) ; also sheet 1
DIG_CSN_ADC.1: U$2.99(N4) ; also sheet 2
DIG_CSN_HP_DAC.0: U$2.16(V9) ; also sheet 1
DIG_CSN_HP_DAC.1: U$2.101(N3) ; also sheet 2
DIG_ENABLECH1.0: U$2.77(V4) ; also sheet 5
DIG_ENABLECH1.1: U$2.157(H4) ; also sheet 5
DIG_ENABLECH2.0: U$2.63(AA1) ; also sheet 5
DIG_ENABLECH2.1: U$2.154(Y14) ; also sheet 5
DIG_ENABLECH3.0: U$2.73(AB15) ; also sheet 5
DIG_ENABLECH3.1: U$2.155(Y11) ; also sheet 5
DIG_ENABLECH4.0: U$2.61(U1) ; also sheet 5
DIG_ENABLECH4.1: U$2.152(W14) ; also sheet 5
DIG_PGAGAIN0.0: U$2.30(W5) ; also sheet 1
DIG_PGAGAIN0.1: U$2.107(M6) ; also sheet 2
DIG_PGAGAIN1.0: U$2.28(W6) ; also sheet 1
DIG_PGAGAIN1.1: U$2.109(M5) ; also sheet 2
DIG_PGAGAIN2.0: U$2.26(Y7) ; also sheet 1
DIG_PGAGAIN2.1: U$2.105(L4) ; also sheet 2
DIG_SCLK.0: U$2.22(W7) ; also sheet 1
DIG_SCLK.1: U$2.95(P5) ; also sheet 2
DIG_SDA.0: U$2.20(V7) ; also sheet 1
DIG_SDA.1: U$2.97(P4) ; also sheet 2
DIG_SELECTCH1.0: U$2.79(W4) ; also sheet 5
DIG_SELECTCH1.1: U$2.159(G4) ; also sheet 5
DIG_SELECTCH2.0: U$2.65(AB1) ; also sheet 5
DIG_SELECTCH2.1: U$2.156(Y12) ; also sheet 5
DIG_SELECTCH3.0: U$2.71(AA15) ; also sheet 5
DIG_SELECTCH3.1: U$2.153(V14) ; also sheet 5
DIG_SELECTCH4.0: U$2.59(T1) ; also sheet 5
DIG_SELECTCH4.1: U$2.150(T15) ; also sheet 5
N$31: U$2.41(R3)
N$39: U$2.121(K1)
VDD3.3 [power]: U$2.09(+3.3VDD) U$2.11(+3.3VDD.1) U$2.13(+3.3VDD.2) U$2.82(+3.3VDD.3) U$2.84(+3.3VDD.4) U$2.86(+3.3VDD.5) ; also sheet 1,2,3
VDD5.0 [power]: CDECAPXEM0.1 CDECAPXEM1.1 CDECAPXEM2.1 U$2.01(+VDCIN) U$2.03(+VDCIN.1) U$2.05(+VDCIN.2) ; also sheet 3
VSS: CDECAPXEM0.2 CDECAPXEM1.2 CDECAPXEM2.2 U$2.02(DGND) U$2.14(DGND.1) U$2.35(DGND.2) U$2.55(DGND.3) U$2.78(DGND.4) U$2.80(DGND.5) U$2.81(DGND.6) U$2.93(DGND.7) U$2.94(DGND.8) U$2.116(DGND.9) U$2.136(DGND.10) U$2.158(DGND.11) U$2.160(DGND.12) ; also sheet 1,2,3,5
Unconnected: U$2.04(+1.0VDD) U$2.06(+1.0VDD.1) U$2.07(+1.8VDD) U$2.08(AB11) U$2.10(M9) U$2.12(L10) U$2.15(W9) U$2.17(Y9) U$2.19(R6) U$2.21(T6) U$2.23(U6) U$2.24(Y8) U$2.25(V5) U$2.27(T5) U$2.29(U5) U$2.31(AA5) U$2.32(R4) U$2.33(AB5) U$2.34(T4) U$2.36(VCCO_MC1) U$2.37(AB7) U$2.38(Y4) U$2.39(AB6) U$2.40(AA4) U$2.42(Y6) U$2.43(R2) U$2.44(AA6) U$2.45(Y3) U$2.46(AA8) U$2.47(AA3) U$2.48(AB8) U$2.49(U2) U$2.50(U3) U$2.51(V2) U$2.52(V3) U$2.53(W2) U$2.54(W1) U$2.56(VCCO_MC1.1) U$2.57(Y2) U$2.58(Y1) U$2.60(AB3) U$2.62(AB2) U$2.64(Y13) U$2.66(AA14) U$2.67(AB16) U$2.68(AA13) U$2.69(AB17) U$2.70(AB13) U$2.72(W15) U$2.74(W16) U$2.75(Y16) U$2.76(AA16) U$2.83(+VCCBATT) U$2.85(V12) U$2.87(T13) U$2.88(U13) U$2.89(R13) U$2.90(F4) U$2.91(AB12) U$2.92(L6) U$2.96(P6) U$2.98(N5) U$2.100(P2) U$2.102(N2) U$2.103(L5) U$2.104(R1) U$2.106(P1) U$2.108(M3) U$2.110(M2) U$2.111(M1) U$2.112(K6) U$2.113(L1) U$2.114(J6) U$2.115(VCCO_MC2) U$2.117(K2) U$2.118(L3) U$2.119(J2) U$2.120(K3) U$2.122(J5) U$2.123(J1) U$2.124(H5) U$2.125(H3) U$2.126(H2) U$2.127(G3) U$2.128(G2) U$2.129(E2) U$2.130(G1) U$2.131(D2) U$2.132(F1) U$2.133(F3) U$2.134(E1) U$2.135(VCCO_MC2.1) U$2.137(E3) U$2.138(D1) U$2.139(B1) U$2.140(C2) U$2.141(A1) U$2.142(B2) U$2.143(K4) U$2.144(U15) U$2.145(J4) U$2.146(V15) U$2.147(T16) U$2.148(T14) U$2.149(U16) U$2.151(V13)

## Sheet 5 of 6
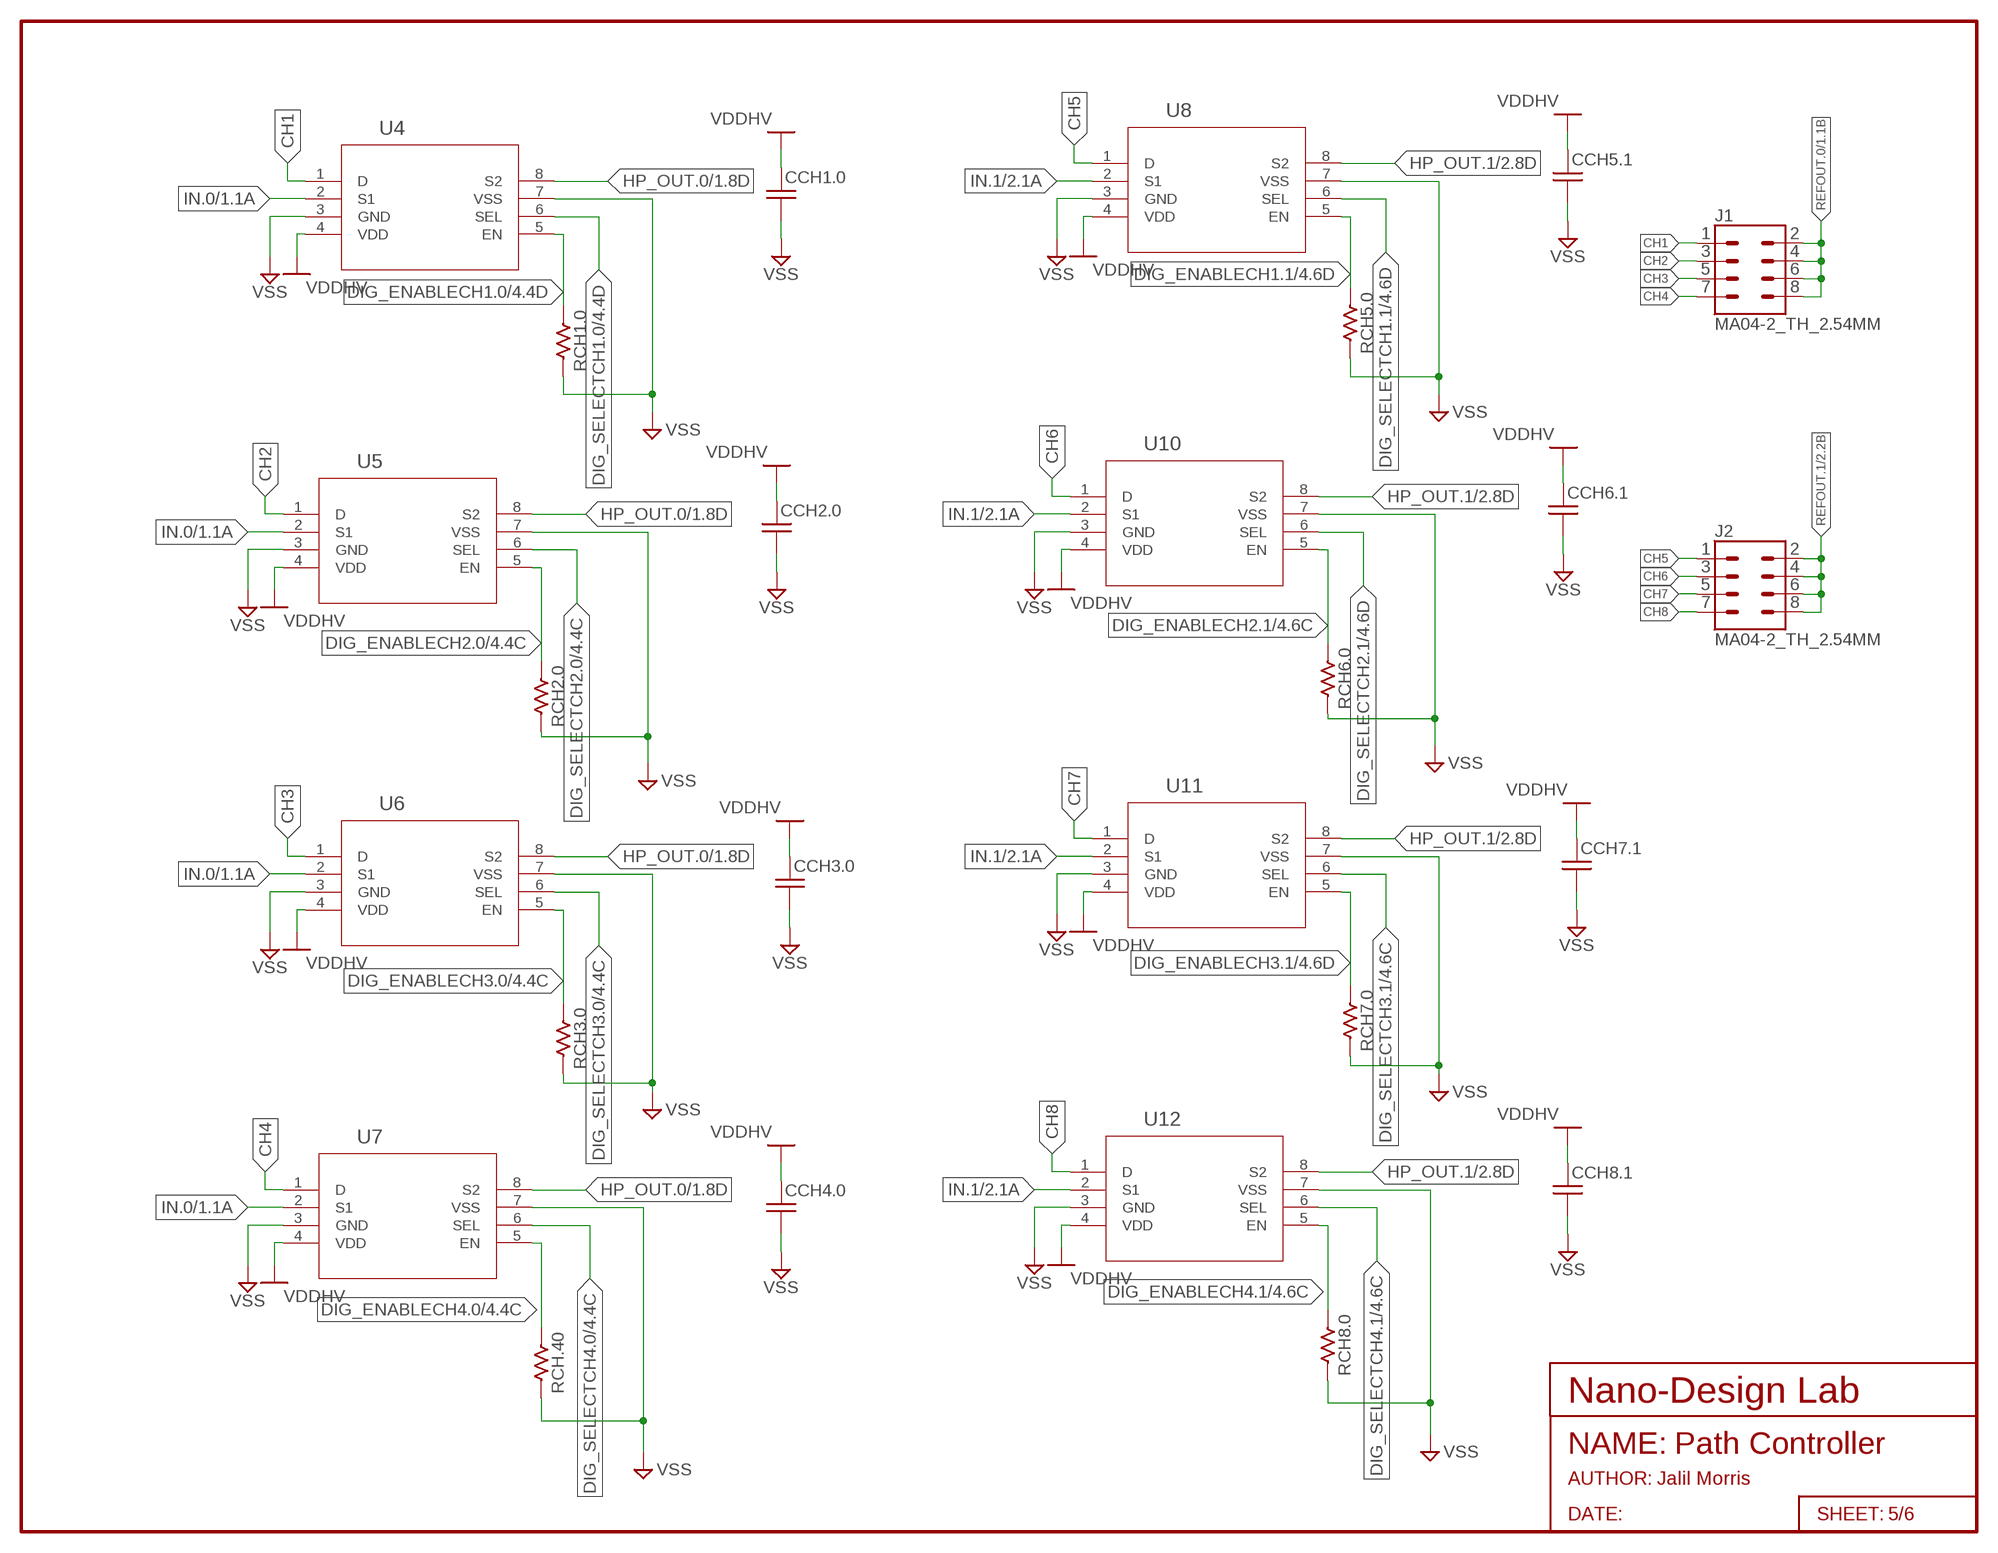
[diagram p4: schematic, sheet 5]
FRAME5 (FRAME): S_AUTHOR: Jalil Morris; S_NAME: Path Controller; S_ORGANIZATION: Nano-Design Lab

### Parts
CCH1.0  C-US0402  [0402]
CCH2.0  C-US0402  [0402]
CCH3.0  C-US0402  [0402]
CCH4.0  C-US0402  [0402]
CCH5.1  C-US0402  [0402]
CCH6.1  C-US0402  [0402]
CCH7.1  C-US0402  [0402]
CCH8.1  C-US0402  [0402]
J1  MA04-2_TH_2.54MM  [MA04-2_TH_2.54MM]
J2  MA04-2_TH_2.54MM  [MA04-2_TH_2.54MM]
RCH1.0  R-US0402  [0402]
RCH2.0  R-US0402  [0402]
RCH3.0  R-US0402  [0402]
RCH5.0  R-US0402  [0402]
RCH6.0  R-US0402  [0402]
RCH7.0  R-US0402  [0402]
RCH8.0  R-US0402  [0402]
RCH.40  R-US0402  [0402]
U4  TMUX7219DGKRVSSOP_9DGKR_TEX  [VSSOP_9DGKR_TEX]
U5  TMUX7219DGKRVSSOP_9DGKR_TEX  [VSSOP_9DGKR_TEX]
U6  TMUX7219DGKRVSSOP_9DGKR_TEX  [VSSOP_9DGKR_TEX]
U7  TMUX7219DGKRVSSOP_9DGKR_TEX  [VSSOP_9DGKR_TEX]
U8  TMUX7219DGKRVSSOP_9DGKR_TEX  [VSSOP_9DGKR_TEX]
U10  TMUX7219DGKRVSSOP_9DGKR_TEX  [VSSOP_9DGKR_TEX]
U11  TMUX7219DGKRVSSOP_9DGKR_TEX  [VSSOP_9DGKR_TEX]
U12  TMUX7219DGKRVSSOP_9DGKR_TEX  [VSSOP_9DGKR_TEX]

### Nets
CH1: J1.1 U4.1(D)
CH2: J1.3 U5.1(D)
CH3: J1.5 U6.1(D)
CH4: J1.7 U7.1(D)
CH5: J2.1 U8.1(D)
CH6: J2.3 U10.1(D)
CH7: J2.5 U11.1(D)
CH8: J2.7 U12.1(D)
DIG_ENABLECH1.0: RCH1.0.1 U4.5(EN) ; also sheet 4
DIG_ENABLECH1.1: RCH5.0.1 U8.5(EN) ; also sheet 4
DIG_ENABLECH2.0: RCH2.0.1 U5.5(EN) ; also sheet 4
DIG_ENABLECH2.1: RCH6.0.1 U10.5(EN) ; also sheet 4
DIG_ENABLECH3.0: RCH3.0.1 U6.5(EN) ; also sheet 4
DIG_ENABLECH3.1: RCH7.0.1 U11.5(EN) ; also sheet 4
DIG_ENABLECH4.0: RCH.40.1 U7.5(EN) ; also sheet 4
DIG_ENABLECH4.1: RCH8.0.1 U12.5(EN) ; also sheet 4
DIG_SELECTCH1.0: U4.6(SEL) ; also sheet 4
DIG_SELECTCH1.1: U8.6(SEL) ; also sheet 4
DIG_SELECTCH2.0: U5.6(SEL) ; also sheet 4
DIG_SELECTCH2.1: U10.6(SEL) ; also sheet 4
DIG_SELECTCH3.0: U6.6(SEL) ; also sheet 4
DIG_SELECTCH3.1: U11.6(SEL) ; also sheet 4
DIG_SELECTCH4.0: U7.6(SEL) ; also sheet 4
DIG_SELECTCH4.1: U12.6(SEL) ; also sheet 4
HP_OUT.0: U4.8(S2) U5.8(S2) U6.8(S2) U7.8(S2) ; also sheet 1
HP_OUT.1: U8.8(S2) U10.8(S2) U11.8(S2) U12.8(S2) ; also sheet 2
IN.0: U4.2(S1) U5.2(S1) U6.2(S1) U7.2(S1) ; also sheet 1
IN.1: U8.2(S1) U10.2(S1) U11.2(S1) U12.2(S1) ; also sheet 2
REFOUT.0: J1.2 J1.4 J1.6 J1.8 ; also sheet 1,3
REFOUT.1: J2.2 J2.4 J2.6 J2.8 ; also sheet 2,3
VDDHV: CCH1.0.1 CCH2.0.1 CCH3.0.1 CCH4.0.1 CCH5.1.1 CCH6.1.1 CCH7.1.1 CCH8.1.1 U4.4(VDD) U5.4(VDD) U6.4(VDD) U7.4(VDD) U8.4(VDD) U10.4(VDD) U11.4(VDD) U12.4(VDD) ; also sheet 1,2,3
VSS: CCH1.0.2 CCH2.0.2 CCH3.0.2 CCH4.0.2 CCH5.1.2 CCH6.1.2 CCH7.1.2 CCH8.1.2 RCH1.0.2 RCH2.0.2 RCH3.0.2 RCH5.0.2 RCH6.0.2 RCH7.0.2 RCH8.0.2 RCH.40.2 U4.3(GND) U4.7(VSS) U5.3(GND) U5.7(VSS) U6.3(GND) U6.7(VSS) U7.3(GND) U7.7(VSS) U8.3(GND) U8.7(VSS) U10.3(GND) U10.7(VSS) U11.3(GND) U11.7(VSS) U12.3(GND) U12.7(VSS) ; also sheet 1,2,3,4

## Sheet 6 of 6
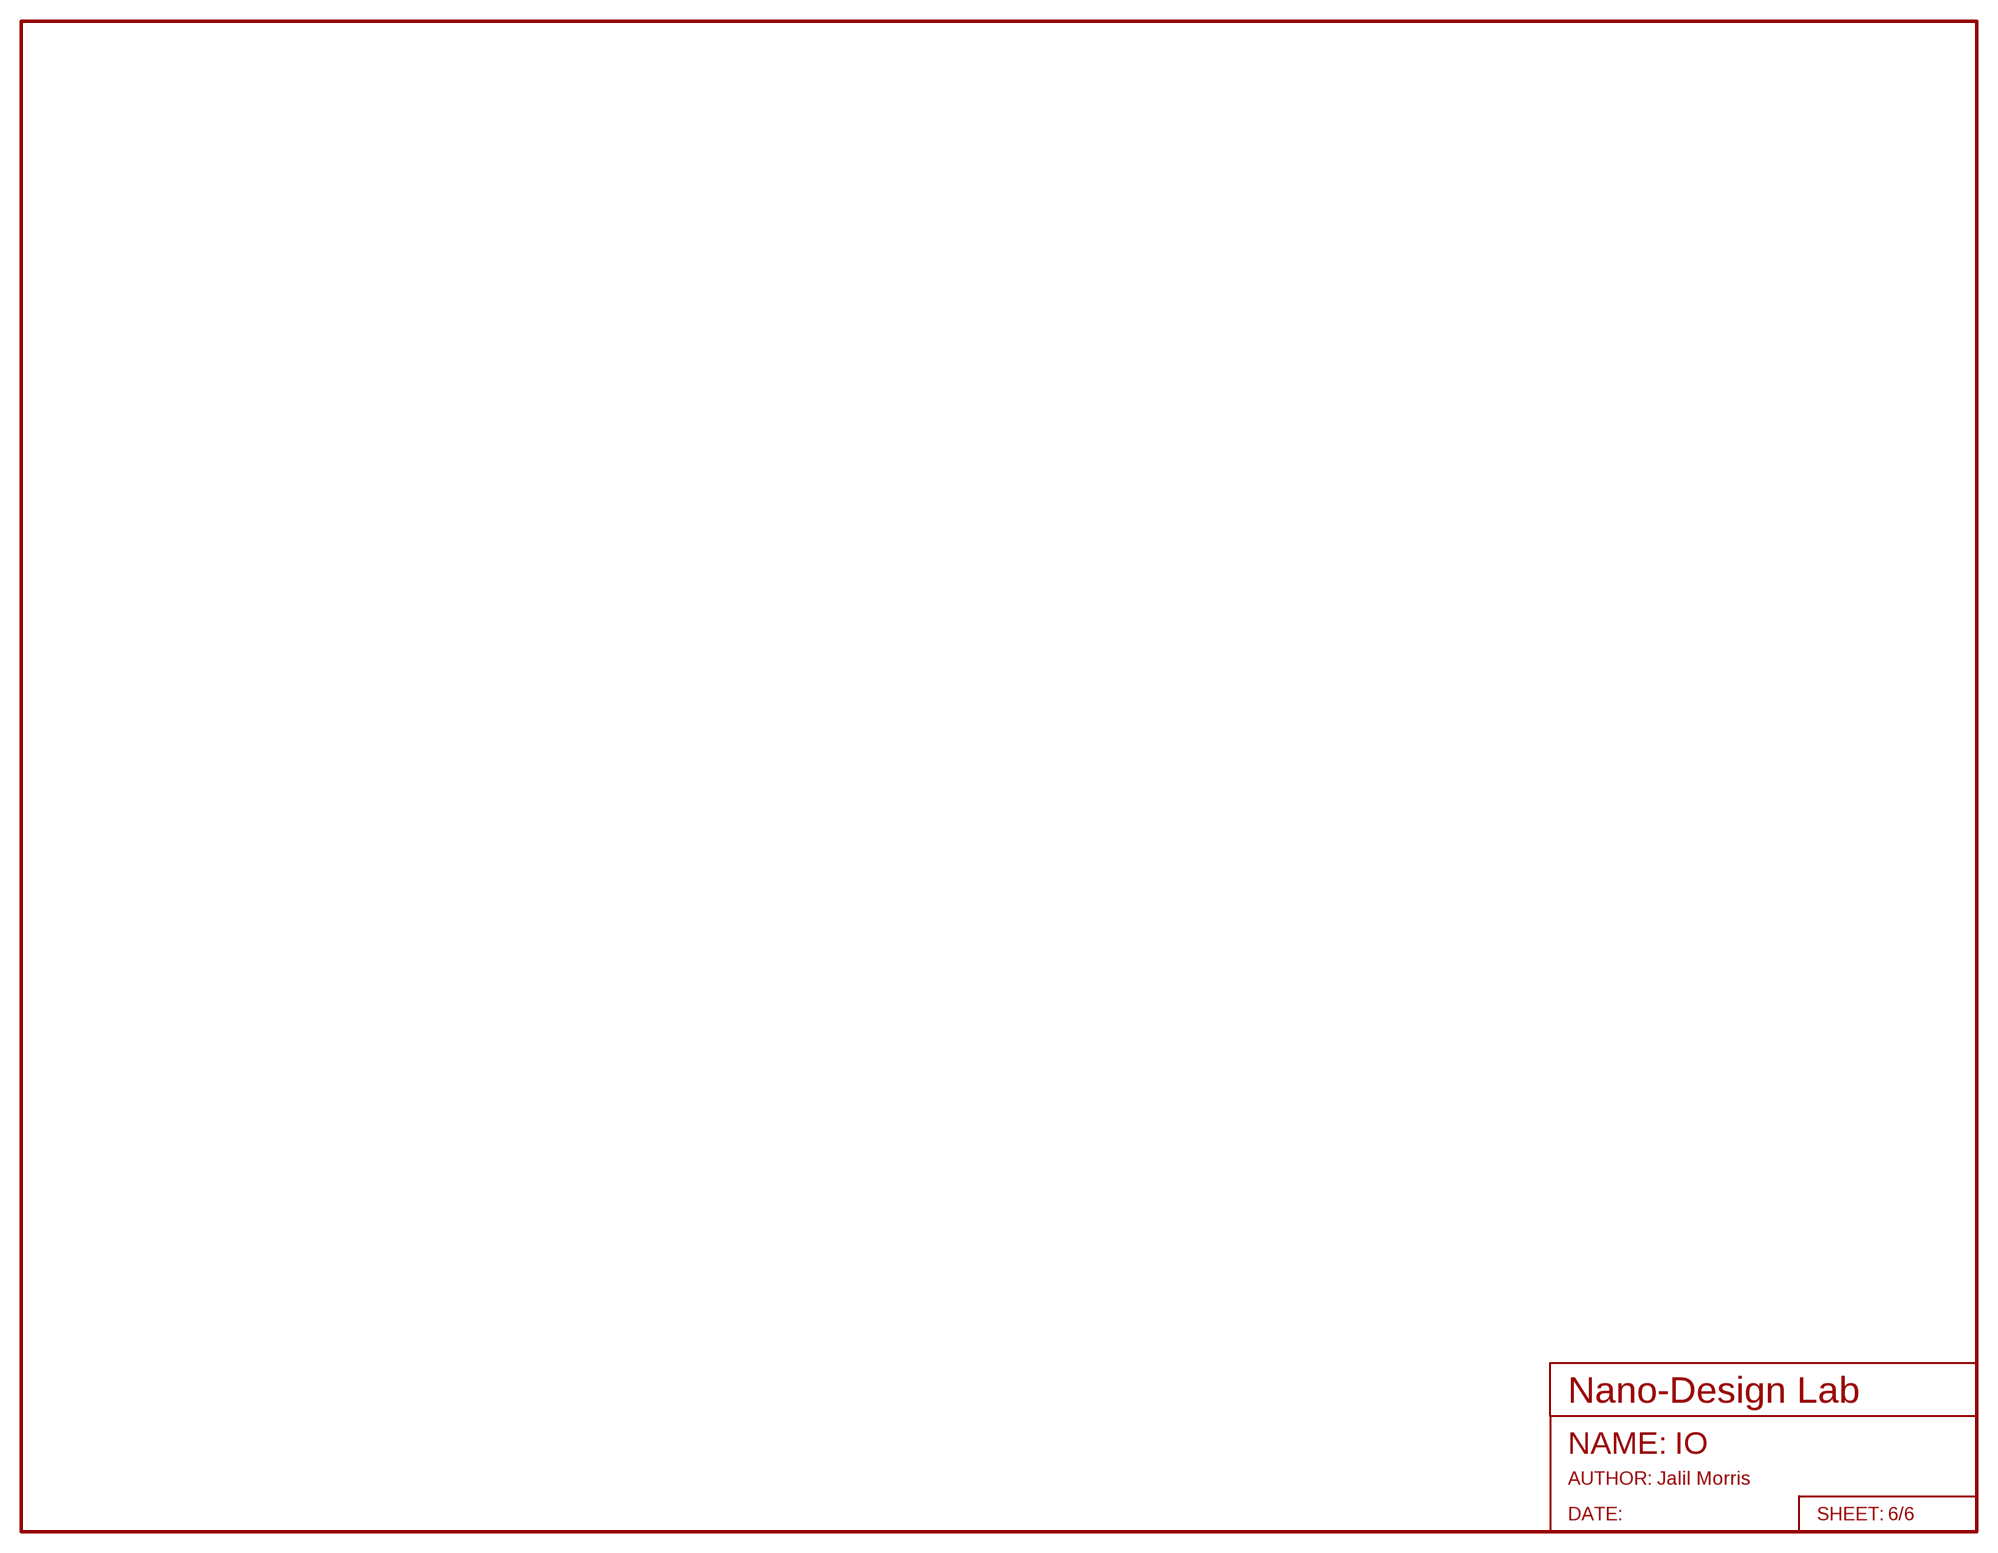
[diagram p5: schematic, sheet 6]
FRAME6 (FRAME): S_AUTHOR: Jalil Morris; S_NAME: IO; S_ORGANIZATION: Nano-Design Lab

## Library data of the parts
ADC.0 ADC.1 = Neural Interface PCB:ADS7042IDCUR; COPYRIGHT: Copyright (C) 2024 Ultra Librarian. All rights reserved.; MANUFACTURER_PART_NUMBER: ADS7042IDCUR; MFR_NAME: Texas Instruments; REFDES: RefDes; TYPE: TYPE
AMPREF.0 AMPREF.1 OUTBUFFER.0 OUTBUFFER.1 = Neural Interface PCB:OPA552UA/2K5; COPYRIGHT: Copyright (C) 2024 Ultra Librarian. All rights reserved.; MANUFACTURER_PART_NUMBER: OPA552UA/2K5; MFR_NAME: Texas Instruments
BANDPASSFILTER1.0 BANDPASSFILTER1.1 BANDPASSFILTER2.0 BANDPASSFILTER2.1 = Neural Interface PCB:OPA2325IDR; COPYRIGHT: Copyright (C) 2024 Ultra Librarian. All rights reserved.; MANUFACTURER_PART_NUMBER: OPA2325IDR; MFR_NAME: Texas Instruments
BOOSTCTRL = Neural Interface PCB:LM51581QRTERQ1; COPYRIGHT: Copyright (C) 2024 Ultra Librarian. All rights reserved.; MANUFACTURER_PART_NUMBER: LM51581QRTERQ1; MFR_NAME: Texas Instruments; REFDES: RefDes; TYPE: TYPE
BOOSTFBPOT = Neural Interface PCB:3362P-1-103LF; COPYRIGHT: Copyright (C) 2024 Ultra Librarian. All rights reserved.; MANUFACTURER_PART_NUMBER: 3362P-1-103LF; MFR_NAME: Bourns Electronics
BOOTSTRAP.0 BOOTSTRAPPER.1 = Neural Interface PCB:DMC4047LSD-13; COPYRIGHT: Copyright (C) 2024 Ultra Librarian. All rights reserved.; MANUFACTURER_PART_NUMBER: DMC4047LSD-13; MFR_NAME: Diodes Inc
CAC1.0 CAC2.0 CADC.0 CADC.1 CBIAS CCOMP CCOMP1 CDECAP0.0 CDECAP0.1 CDECAP1.0 CDECAP1.1 CDECAP2.0 CDECAP2.1 CDECAP3.0 CDECAP3.1 CDECAP4.0 CDECAP4.1 CDECAP5.0 CDECAP5.1 CDECAP6.0 CDECAP6.1 CDECAP7.0 CDECAP7.1-CDECAP7.3 CDECAP8.0 CDECAP8.1 CDECAP9.0 CDECAP9.1 CDECAPREF.0 CDECAPREF.1 CDECAPXEM0 CDECAPXEM1 CDECAPXEM2 CH1.0 CH2.0 CH3.0 CH4.0 CL1.0 CL2.0 CL3.0 CL4.0 COUT1-COUT3 CREF0.0 CREF0.1 CREF1.0 CREF1.1 CREF2.0 CREF2.1 CREF3.0 CREF3.1 CRFI.0 CSS CVDD = Neural Interface PCB:C-US: CAPACITOR US symbol
CAC1.1 CAC2.1 CCH1.0 CCH2.0 CCH3.0 CCH4.0 CCH5.1 CCH6.1 CCH7.1 CCH8.1 CH1.1 CH2.1 CH3.1 CH4.1 CL1.1 CL2.1 CL3.1 CL4.1 CRFI.1 = esbd-passives:C-US: CAPACITOR US symbol
D1 = Neural Interface PCB:B160-13-F; COPYRIGHT: Copyright (C) 2024 Ultra Librarian. All rights reserved.; MANUFACTURER_PART_NUMBER: B160-13-F; MFR_NAME: Diodes Inc
DAC.0 DAC.1 = Neural Interface PCB:DAC081S101CIMKX/NOPB; COPYRIGHT: Copyright (C) 2024 Ultra Librarian. All rights reserved.; MANUFACTURER_PART_NUMBER: DAC081S101CIMKX/NOPB; MFR_NAME: Texas Instruments
HPAMPS.0 HPAMPS.1 = Neural Interface PCB:OPA2991IDR; COPYRIGHT: Copyright (C) 2024 Ultra Librarian. All rights reserved.; MANUFACTURER_PART_NUMBER: OPA2991IDR; MFR_NAME: Texas Instruments; REFDES: RefDes; TYPE: TYPE
J1 J2 = Neural Interface PCB:MA04-2: PIN HEADER
J3 J4 = Neural Interface PCB:MA03-1: PIN HEADER
NAREFH.0 NAREFH.1 NAREFL.0 NAREFL.1\ RAC1.0 RAC2.0 RAC3.0 RADC.3 RBYPASSVDD RBYPASSVSS RCOMP RDAC.2 RGAINPREAMP.0 RH1.0 RH2.0 RH3.0 RH4.0 RL1.0 RL2.0 RL3.0 RL4.0 RT = Neural Interface PCB:R-US: RESISTOR US symbol
PGA.0 PGA.1 = Neural Interface PCB:LTC6911CMS-1TRPBF; COPYRIGHT: Copyright (C) 2024 Ultra Librarian. All rights reserved.; MANUFACTURER_PART_NUMBER: LTC6911CMS-1#TRPBF; MFR_NAME: Analog Devices Inc
PREAMPLIFIER.0 PREAMPLIFIER.1 = Neural Interface PCB:INA818ID; COPYRIGHT: Copyright (C) 2024 Ultra Librarian. All rights reserved.; MANUFACTURER_PART_NUMBER: INA818ID; MFR_NAME: Texas Instruments
RAC1.1 RAC2.1 RAC3.1 RADC.1 RBOOSTFB0 RBOOSTFB1 RBOOSTMID0.0 RBOOSTMID0.1 RBOOSTMID1.0 RBOOSTMID1.1 RBOOT0.0 RBOOT0.1 RBOOT1.0 RBOOT1.1 RBOOT2.0 RBOOT2.1 RBOOT3.0 RBOOT3.1 RBYPASSVDD.1 RBYPASSVSS.1 RCH1.0 RCH2.0 RCH3.0 RCH5.0 RCH6.0 RCH7.0 RCH8.0 RCH.40 RDAC.1 RGAINPREAMP.1 RH1.1 RH2.1 RH3.1 RH4.1 RHP0.0 RHP0.1 RHP1.0 RHP1.1 RHP2.0 RHP2.1 RHP3.0 RHP3.1 RL1.1 RL2.1 RL3.1 RL4.1 RSTIM.0 RSTIM.1 = esbd-passives:R-US: RESISTOR US symbol
U1 U2 = Neural Interface PCB:BUF634AIDR
U4-U8 U10-U12 = Neural Interface PCB:TMUX7219DGKR; COPYRIGHT: Copyright (C) 2024 Ultra Librarian. All rights reserved.; MANUFACTURER_PART_NUMBER: TMUX7219DGKR; MFR_NAME: Texas Instruments
U$1 = Neural Interface PCB:MSS1246-COILCRAFT
U$2 = Neural Interface PCB:XEM7310

## Net classes
1 power: width 0.2 mm